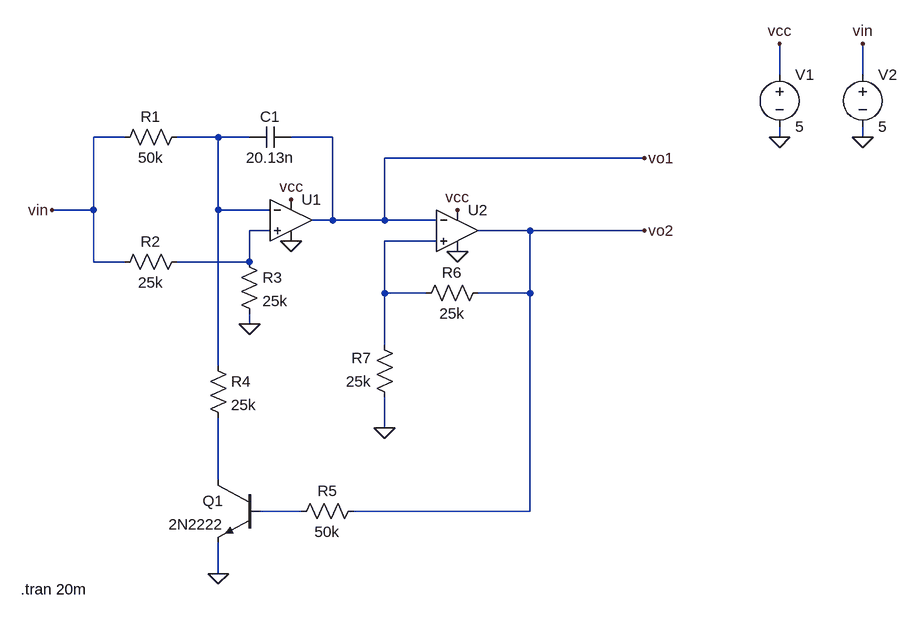
[diagram p0: schematic VCO.asc]
VCO.asc, the LTspice schematic file:
Version 4
SHEET 1 1164 696
WIRE 928 -112 928 -160
WIRE 1056 -112 1056 -160
WIRE -80 -16 -128 -16
WIRE 64 -16 0 -16
WIRE 112 -16 64 -16
WIRE 240 -16 176 -16
WIRE 928 -16 928 -32
WIRE 1056 -16 1056 -32
WIRE 720 16 320 16
WIRE -128 96 -128 -16
WIRE -128 96 -192 96
WIRE 64 96 64 -16
WIRE 144 96 64 96
WIRE 240 112 240 -16
WIRE 240 112 208 112
WIRE 320 112 320 16
WIRE 320 112 240 112
WIRE 400 112 320 112
WIRE 144 128 112 128
WIRE 544 128 464 128
WIRE 720 128 544 128
WIRE 400 144 320 144
WIRE -128 176 -128 96
WIRE -80 176 -128 176
WIRE 112 176 112 128
WIRE 112 176 0 176
WIRE 320 224 320 144
WIRE 384 224 320 224
WIRE 544 224 544 128
WIRE 544 224 464 224
WIRE 112 272 112 256
WIRE 320 304 320 224
WIRE 64 336 64 96
WIRE 320 432 320 384
WIRE 64 512 64 416
WIRE 192 560 128 560
WIRE 544 560 544 224
WIRE 544 560 272 560
WIRE 64 656 64 608
FLAG 176 144 0
FLAG 176 80 vcc
FLAG 432 160 0
FLAG 432 96 vcc
FLAG 720 16 vo1
FLAG 720 128 vo2
FLAG -192 96 vin
FLAG 112 272 0
FLAG 64 656 0
FLAG 320 432 0
FLAG 928 -160 vcc
FLAG 928 -16 0
FLAG 1056 -160 vin
FLAG 1056 -16 0
SYMBOL Opamps\\UniversalOpamp2 176 112 R0
SYMATTR InstName U1
SYMBOL Opamps\\UniversalOpamp2 432 128 R0
SYMATTR InstName U2
SYMBOL cap 176 -32 R90
WINDOW 0 0 32 VBottom 2
WINDOW 3 32 32 VTop 2
SYMATTR InstName C1
SYMATTR Value 20.13n
SYMBOL res 16 160 R90
WINDOW 0 0 56 VBottom 2
WINDOW 3 32 56 VTop 2
SYMATTR InstName R2
SYMATTR Value 25k
SYMBOL res 96 160 R0
SYMATTR InstName R3
SYMATTR Value 25k
SYMBOL res 48 320 R0
SYMATTR InstName R4
SYMATTR Value 25k
SYMBOL npn 128 512 M0
SYMATTR InstName Q1
SYMATTR Value 2N2222
SYMBOL res 288 544 R90
WINDOW 0 0 56 VBottom 2
WINDOW 3 32 56 VTop 2
SYMATTR InstName R5
SYMATTR Value 50k
SYMBOL res 480 208 R90
WINDOW 0 0 56 VBottom 2
WINDOW 3 32 56 VTop 2
SYMATTR InstName R6
SYMATTR Value 25k
SYMBOL res 336 400 R180
WINDOW 0 36 76 Left 2
WINDOW 3 36 40 Left 2
SYMATTR InstName R7
SYMATTR Value 25k
SYMBOL res 16 -32 R90
WINDOW 0 0 56 VBottom 2
WINDOW 3 32 56 VTop 2
SYMATTR InstName R1
SYMATTR Value 50k
SYMBOL voltage 928 -128 R0
SYMATTR InstName V1
SYMATTR Value 5
SYMBOL voltage 1056 -128 R0
WINDOW 123 0 0 Left 0
WINDOW 39 0 0 Left 0
SYMATTR InstName V2
SYMATTR Value 5
TEXT -240 680 Left 2 !.tran 20m

The netlist it stands for:
* VCO.asc
XU1 N002 N001 vcc 0 vo1 level.2 Avol=1Meg GBW=10Meg Slew=10Meg ilimit=25m rail=0 Vos=0 phimargin=45 en=0 enk=0 in=0 ink=0 Rin=500Meg  ; pins IN+ IN- V+ V- OUT
XU2 N003 vo1 vcc 0 vo2 level.2 Avol=1Meg GBW=10Meg Slew=10Meg ilimit=25m rail=0 Vos=0 phimargin=45 en=0 enk=0 in=0 ink=0 Rin=500Meg  ; pins IN+ IN- V+ V- OUT
C1 vo1 N001 20.13n
R2 N002 vin 25k
R3 N002 0 25k
R4 N001 N004 25k
Q1 N004 N005 0 0 2N2222
R5 vo2 N005 50k
R6 vo2 N003 25k
R7 0 N003 25k
R1 N001 vin 50k
V1 vcc 0 5
V2 vin 0 5
.model NPN NPN
.model PNP PNP
.lib standard.bjt
.tran 20m
.lib UniversalOpamps2.sub
.backanno
.end